# EAGLE design adder (EAGLE 7.6.0)
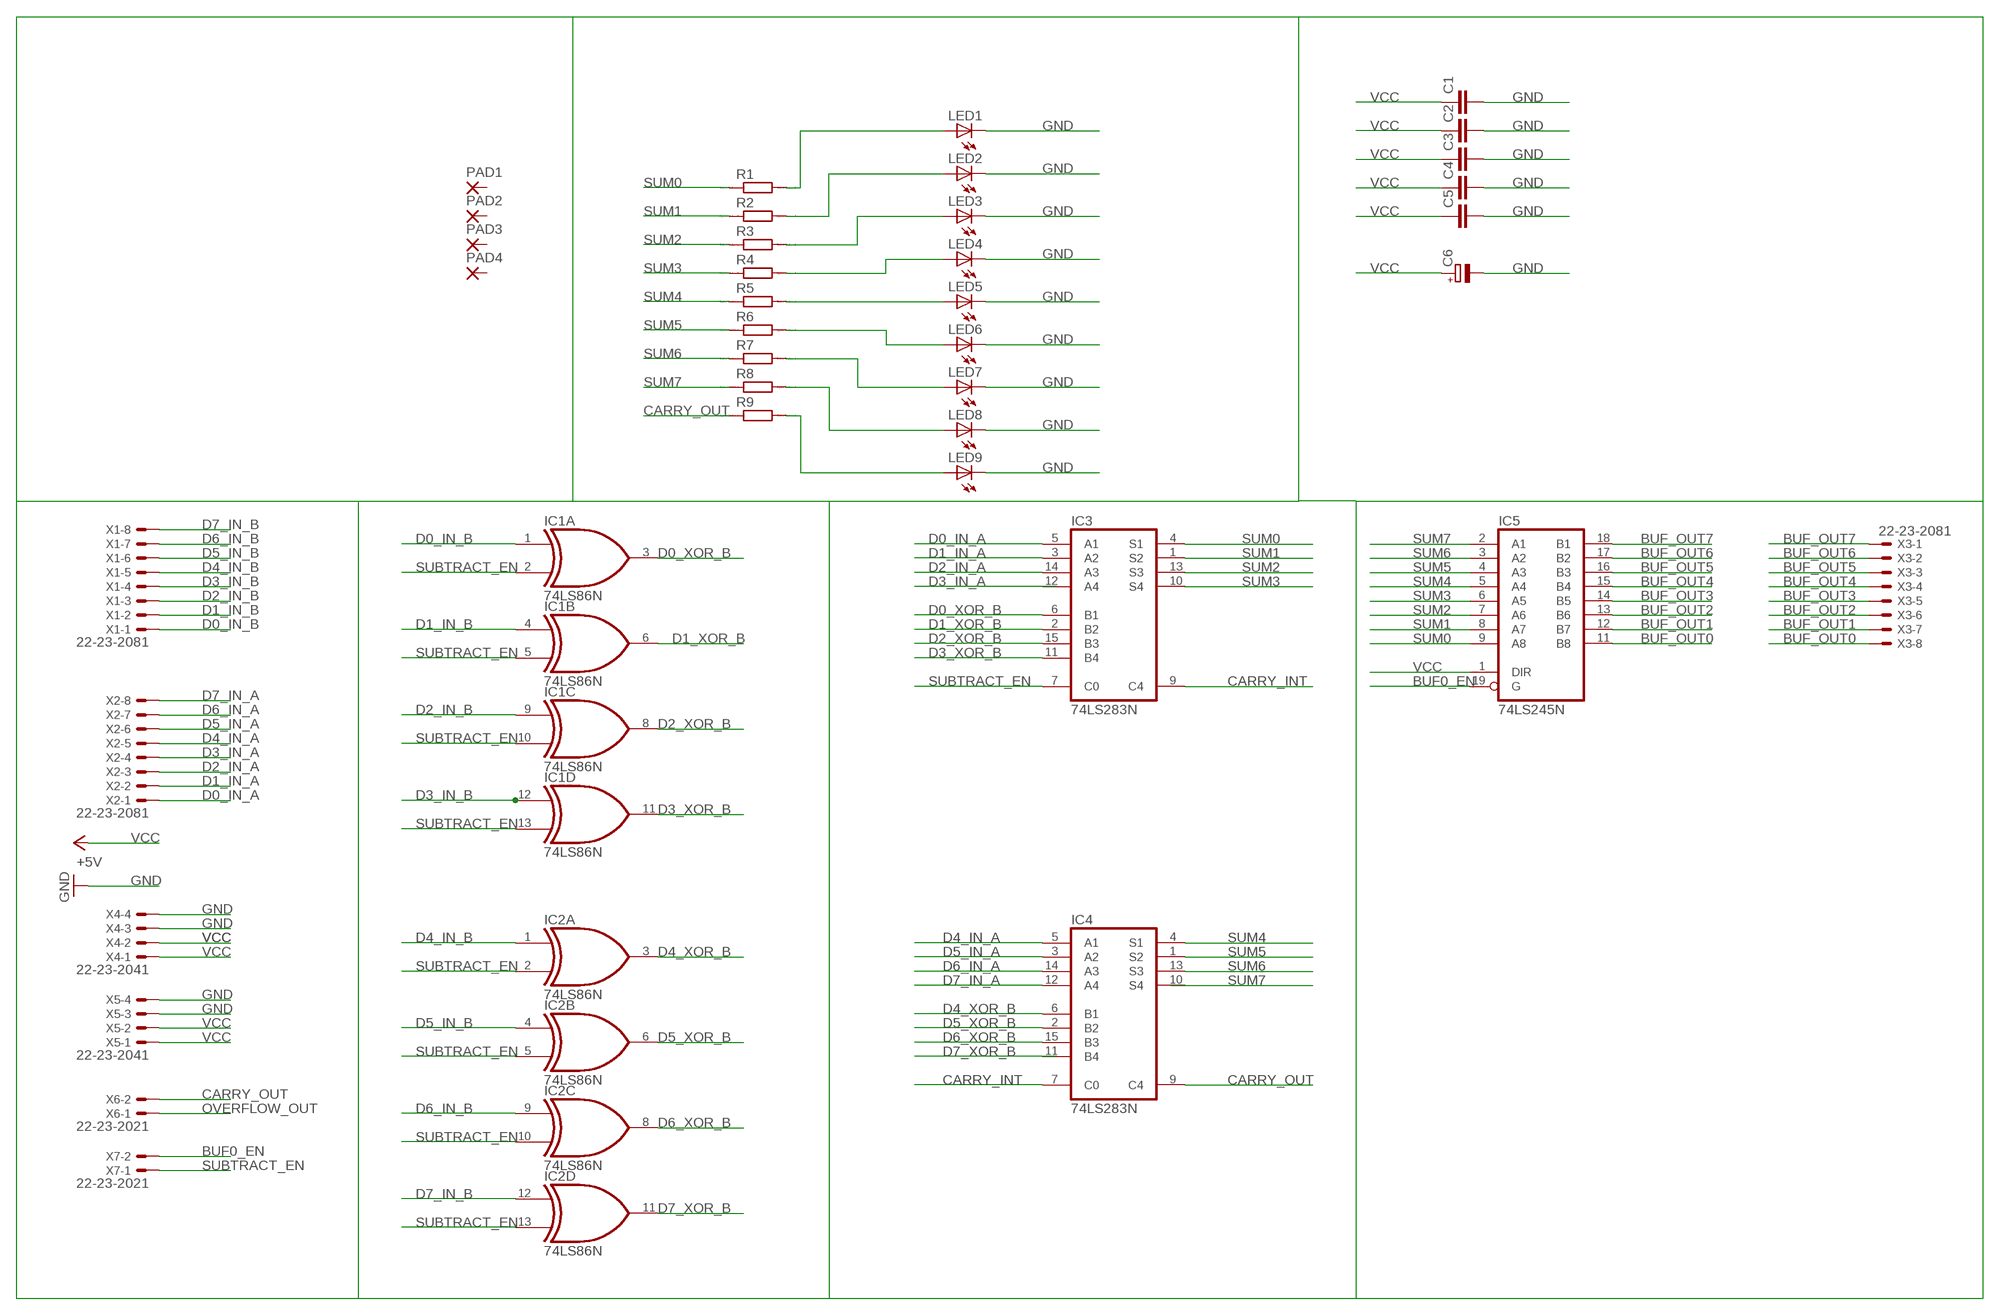
[diagram p0: schematic, sheet 1]

## Parts
C1  C-EU025-025X050  [C025-025X050]
C2  C-EU025-025X050  [C025-025X050]
C3  C-EU025-025X050  [C025-025X050]
C4  C-EU025-025X050  [C025-025X050]
C5  C-EU025-025X050  [C025-025X050]
C6  CPOL-EUE2.5-6  [E2,5-6]
IC1  74LS86N  [DIL14]
IC2  74LS86N  [DIL14]
IC3  74LS283N  [DIL16]
IC4  74LS283N  [DIL16]
IC5  74LS245N  [DIL20]
LED1  LED5MM  [LED5MM]
LED2  LED5MM  [LED5MM]
LED3  LED5MM  [LED5MM]
LED4  LED5MM  [LED5MM]
LED5  LED5MM  [LED5MM]
LED6  LED5MM  [LED5MM]
LED7  LED5MM  [LED5MM]
LED8  LED5MM  [LED5MM]
LED9  LED5MM  [LED5MM]
PAD1  3,17/1,3  [3,17/1,3]
PAD2  3,17/1,3  [3,17/1,3]
PAD3  3,17/1,3  [3,17/1,3]
PAD4  3,17/1,3  [3,17/1,3]
R1  R0207/10  [0207/10]
R2  R0207/10  [0207/10]
R3  R0207/10  [0207/10]
R4  R0207/10  [0207/10]
R5  R0207/10  [0207/10]
R6  R0207/10  [0207/10]
R7  R0207/10  [0207/10]
R8  R0207/10  [0207/10]
R9  R0207/10  [0207/10]
X1  22-23-2081  [22-23-2081]
X2  22-23-2081  [22-23-2081]
X3  22-23-2081  [22-23-2081]
X4  22-23-2041  [22-23-2041]
X5  22-23-2041  [22-23-2041]
X6  22-23-2021  [22-23-2021]
X7  22-23-2021  [22-23-2021]

## Nets
BUF0_EN: IC5.19(G) X7.2
BUF_OUT0: IC5.11(B8) X3.8
BUF_OUT1: IC5.12(B7) X3.7
BUF_OUT2: IC5.13(B6) X3.6
BUF_OUT3: IC5.14(B5) X3.5
BUF_OUT4: IC5.15(B4) X3.4
BUF_OUT5: IC5.16(B3) X3.3
BUF_OUT6: IC5.17(B2) X3.2
BUF_OUT7: IC5.18(B1) X3.1
CARRY_INT: IC3.9(C4) IC4.7(C0)
CARRY_OUT: IC4.9(C4) R9.1 X6.2
D0_IN_A: IC3.5(A1) X2.1
D0_IN_B: IC1.1(A:I0) X1.1
D0_XOR_B: IC1.3(A:O) IC3.6(B1)
D1_IN_A: IC3.3(A2) X2.2
D1_IN_B: IC1.4(B:I0) X1.2
D1_XOR_B: IC1.6(B:O) IC3.2(B2)
D2_IN_A: IC3.14(A3) X2.3
D2_IN_B: IC1.9(C:I0) X1.3
D2_XOR_B: IC1.8(C:O) IC3.15(B3)
D3_IN_A: X2.4
D3_IN_B: IC1.12(D:I0) X1.4
D3_XOR_B: IC1.11(D:O) IC3.11(B4)
D4_IN_A: IC4.5(A1) X2.5
D4_IN_B: IC2.1(A:I0) X1.5
D4_XOR_B: IC2.3(A:O) IC4.6(B1)
D5_IN_A: IC4.3(A2) X2.6
D5_IN_B: IC2.4(B:I0) X1.6
D5_XOR_B: IC2.6(B:O) IC4.2(B2)
D6_IN_A: IC4.14(A3) X2.7
D6_IN_B: IC2.9(C:I0) X1.7
D6_XOR_B: IC2.8(C:O) IC4.15(B3)
D7_IN_A: IC4.12(A4) X2.8
D7_IN_B: IC2.12(D:I0) X1.8
D7_XOR_B: IC2.11(D:O)
GND [suply]: C1.2 C2.2 C3.2 C4.2 C5.2 C6.- LED1.K(C) LED2.K(C) LED3.K(C) LED4.K(C) LED5.K(C) LED6.K(C) LED7.K(C) LED8.K(C) LED9.K(C) X4.3 X4.4 X5.3 X5.4
N$62: LED1.A R1.2
N$63: LED2.A R2.2
N$64: LED3.A R3.2
N$65: LED4.A R4.2
N$66: LED5.A R5.2
N$67: LED9.A R9.2
N$68: LED8.A R8.2
N$69: LED7.A R7.2
N$70: LED6.A R6.2
OVERFLOW_OUT: X6.1
SUBTRACT_EN: IC1.2(A:I1) IC1.5(B:I1) IC1.10(C:I1) IC1.13(D:I1) IC2.2(A:I1) IC2.5(B:I1) IC2.10(C:I1) IC2.13(D:I1) IC3.7(C0) X7.1
SUM0: IC3.4(S1) IC5.9(A8) R1.1
SUM1: IC3.1(S2) IC5.8(A7) R2.1
SUM2: IC3.13(S3) IC5.7(A6) R3.1
SUM3: IC3.10(S4) IC5.6(A5) R4.1
SUM4: IC4.4(S1) IC5.5(A4) R5.1
SUM5: IC4.1(S2) IC5.4(A3) R6.1
SUM6: IC4.13(S3) IC5.3(A2) R7.1
SUM7: IC5.2(A1) R8.1
VCC [suply]: C1.1 C2.1 C3.1 C4.1 C5.1 C6.+ IC5.1(DIR) X4.1 X4.2 X5.1 X5.2 ; supply symbol labelled +5V
Unconnected: IC3.12(A4) IC4.10(S4) IC4.11(B4) PAD1.1(P) PAD2.1(P) PAD3.1(P) PAD4.1(P)

## Power pins joined to a net without a drawn wire
GND: IC1.7(P:GND) IC2.7(P:GND) IC3.8(GND) IC4.8(GND) IC5.10(GND)
VCC: IC1.14(P:VCC) IC2.14(P:VCC) IC3.16(VCC) IC4.16(VCC) IC5.20(VCC)

## Library data of the parts
C1-C5 = rcl:C-EU: CAPACITOR, European symbol
C6 = rcl:CPOL-EU: POLARIZED CAPACITOR, European symbol
IC1 IC2 = 74xx-us:74*86: Quad 2-input EXCLUSIV-OR (XOR) gate
IC3 IC4 = 74xx-us:74*283: 4-bit binary FULL ADDER, fast carry
IC5 = 74xx-us:74*245: Octal BUS TRANSCEIVER, 3-state
LED1-LED9 = led:LED: LED OSRAM: - CHIPLED LG R971, LG N971, LY N971, LG Q971, LY Q971, LO R971, LY R971 LH N974, LH R974 LS Q976, LO Q976, LY Q976 LO Q996 - Hyper CHIPLED LW Q18S LB Q993, LB Q99A, LB R99A - SideLED LS A670, LO A670, LY A670, LG A670, LP A670 LB A673, LV A673, LT A673, LW A673 LH A674 LY A675 LS A676, LA A676, LO A676, LY A676, LW A676 LS A679, LY A679, LG A679 - Hyper Micro SIDELED® LS Y876, LA Y876, LO Y876, LY Y876 LT Y87S - SmartLED LW L88C, LW L88S LB L89C, LB L89S, LG L890 LS L89K, LO L89K, LY L89K LS L896, LA L896, LO L896, LY L896 - TOPLED LS T670, LO T670, LY T670, LG T670, LP T670 LSG T670, LSP T670, LSY T670, LOP T670, LYG T670 LG T671, LOG T671, LSG T671 LB T673, LV T673, LT T673, LW T673 LH T674 LS T676, LA T676, LO T676, LY T676, LB T676, LH T676, LSB T676, LW T676 LB T67C, LV T67C, LT T67C, LS T67K, LO T67K, LY T67K, LW E67C LS E67B, LA E67B, LO E67B, LY E67B, LB E67C, LV E67C, LT E67C LW T67C LS T679, LY T679, LG T679 LS T770, LO T770, LY T770, LG T770, LP T770 LB T773, LV T773, LT T773, LW T773 LH T774 LS E675, LA E675, LY E675, LS T675 LS T776, LA T776, LO T776, LY T776, LB T776 LHGB T686 LT T68C, LB T68C - Hyper Mini TOPLED® LB M676 - Mini TOPLED Santana® LG M470 LS M47K, LO M47K, LY M47K Source: http://www.osram.convergy.de LUXEON: - LUMILED® LXK2-PW12-R00, LXK2-PW12-S00, LXK2-PW14-U00, LXK2-PW14-V00 LXK2-PM12-R00, LXK2-PM12-S00, LXK2-PM14-U00 LXK2-PE12-Q00, LXK2-PE12-R00, LXK2-PE12-S00, LXK2-PE14-T00, LXK2-PE14-U00 LXK2-PB12-K00, LXK2-PB12-L00, LXK2-PB12-M00, LXK2-PB14-N00, LXK2-PB14-P00, LXK2-PB14-Q00 LXK2-PR12-L00, LXK2-PR12-M00, LXK2-PR14-Q00, LXK2-PR14-R00 LXK2-PD12-Q00, LXK2-PD12-R00, LXK2-PD12-S00 LXK2-PH12-R00, LXK2-PH12-S00 LXK2-PL12-P00, LXK2-PL12-Q00, LXK2-PL12-R00 Source: www.luxeon.com KINGBRIGHT: KA-3528ASYC Source: www.kingbright.com
PAD1-PAD4 = wirepad:3,17/1,3: THROUGH-HOLE PAD
R1-R9 = eagle-ltspice:R: RESISTOR, European symbol; SPICEMODEL: NONE; SPICEPREFIX: R
X1-X3 = con-molex:22-23-2081: .100" (2.54mm) Center Header - 8 Pin; MF: MOLEX; MPN: 22-23-2081; OC_FARNELL: 1756826; OC_NEWARK: 01C7592
X4 X5 = con-molex:22-23-2041: .100" (2.54mm) Center Header - 4 Pin; MF: MOLEX; MPN: 22-23-2041; OC_FARNELL: 1462920; OC_NEWARK: 38C0355
X6 X7 = con-molex:22-23-2021: .100" (2.54mm) Center Header - 2 Pin; MF: MOLEX; MPN: 22-23-2021; OC_FARNELL: 1462926; OC_NEWARK: 25C3832

## Net classes
1 suply: width 1.016 mm

## Board
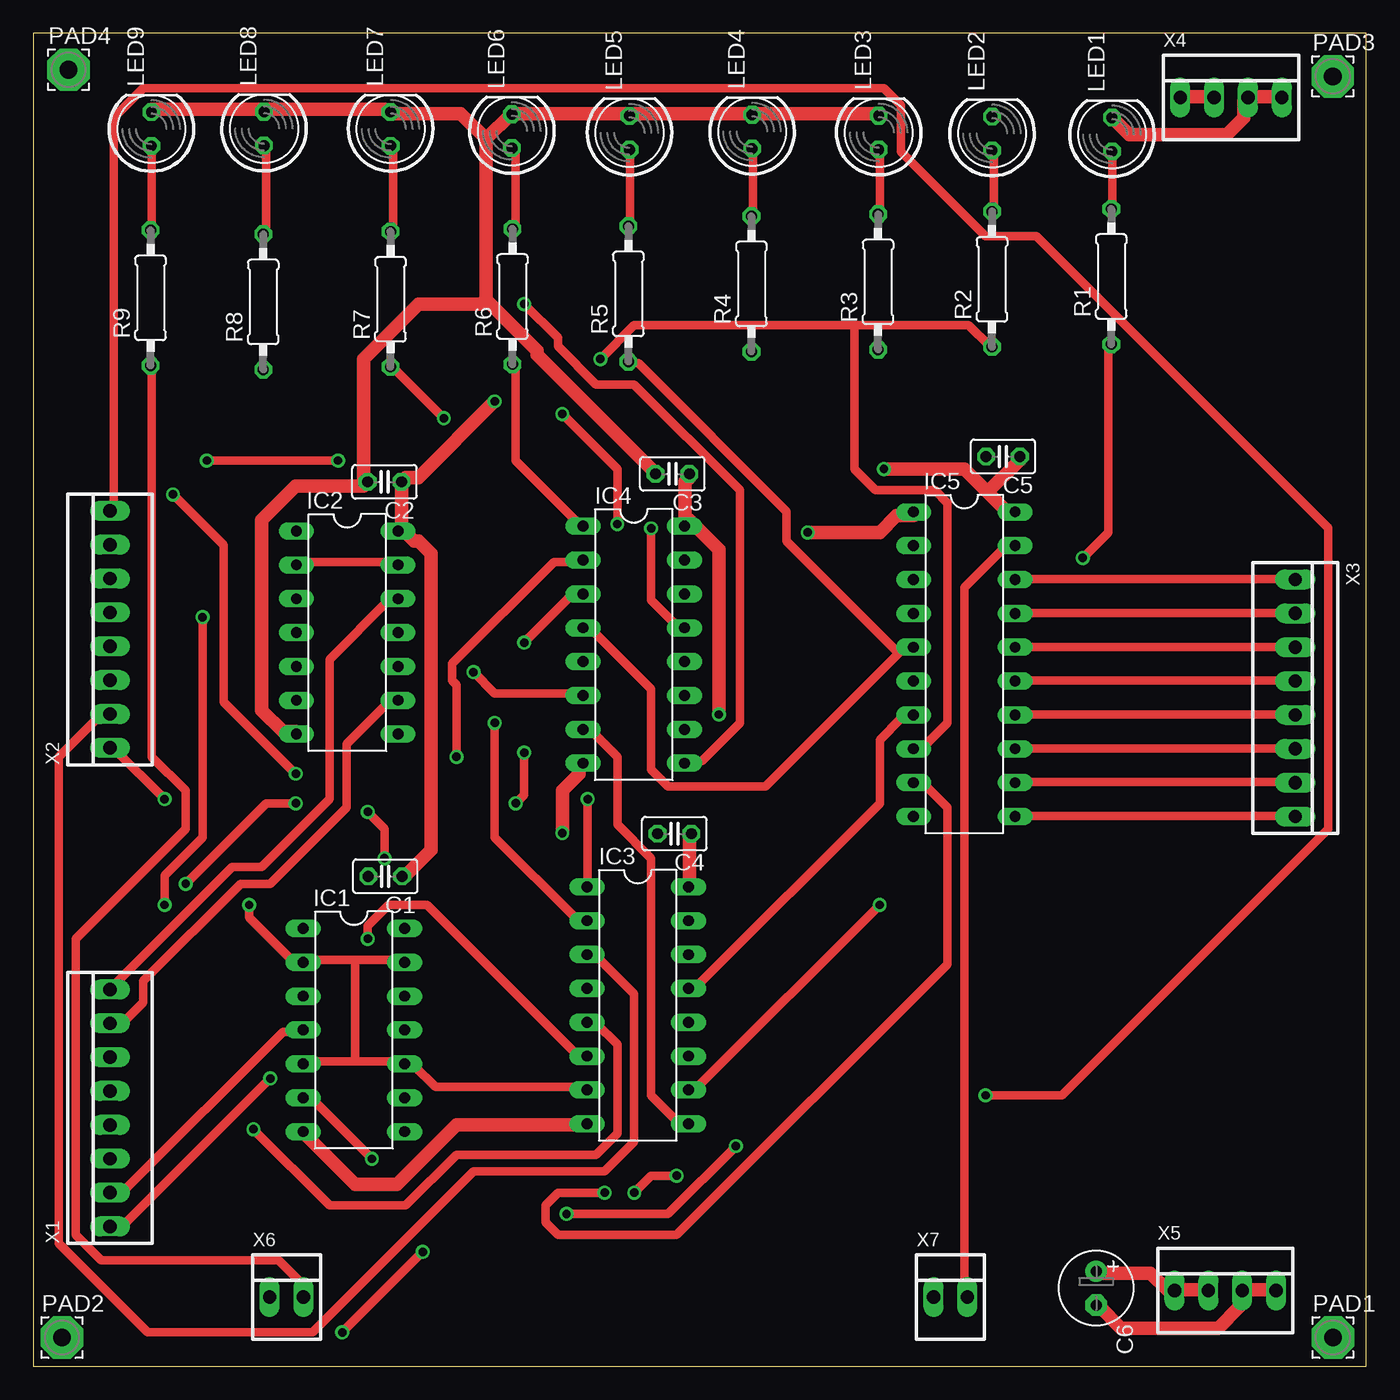
[diagram p1: board, top side]
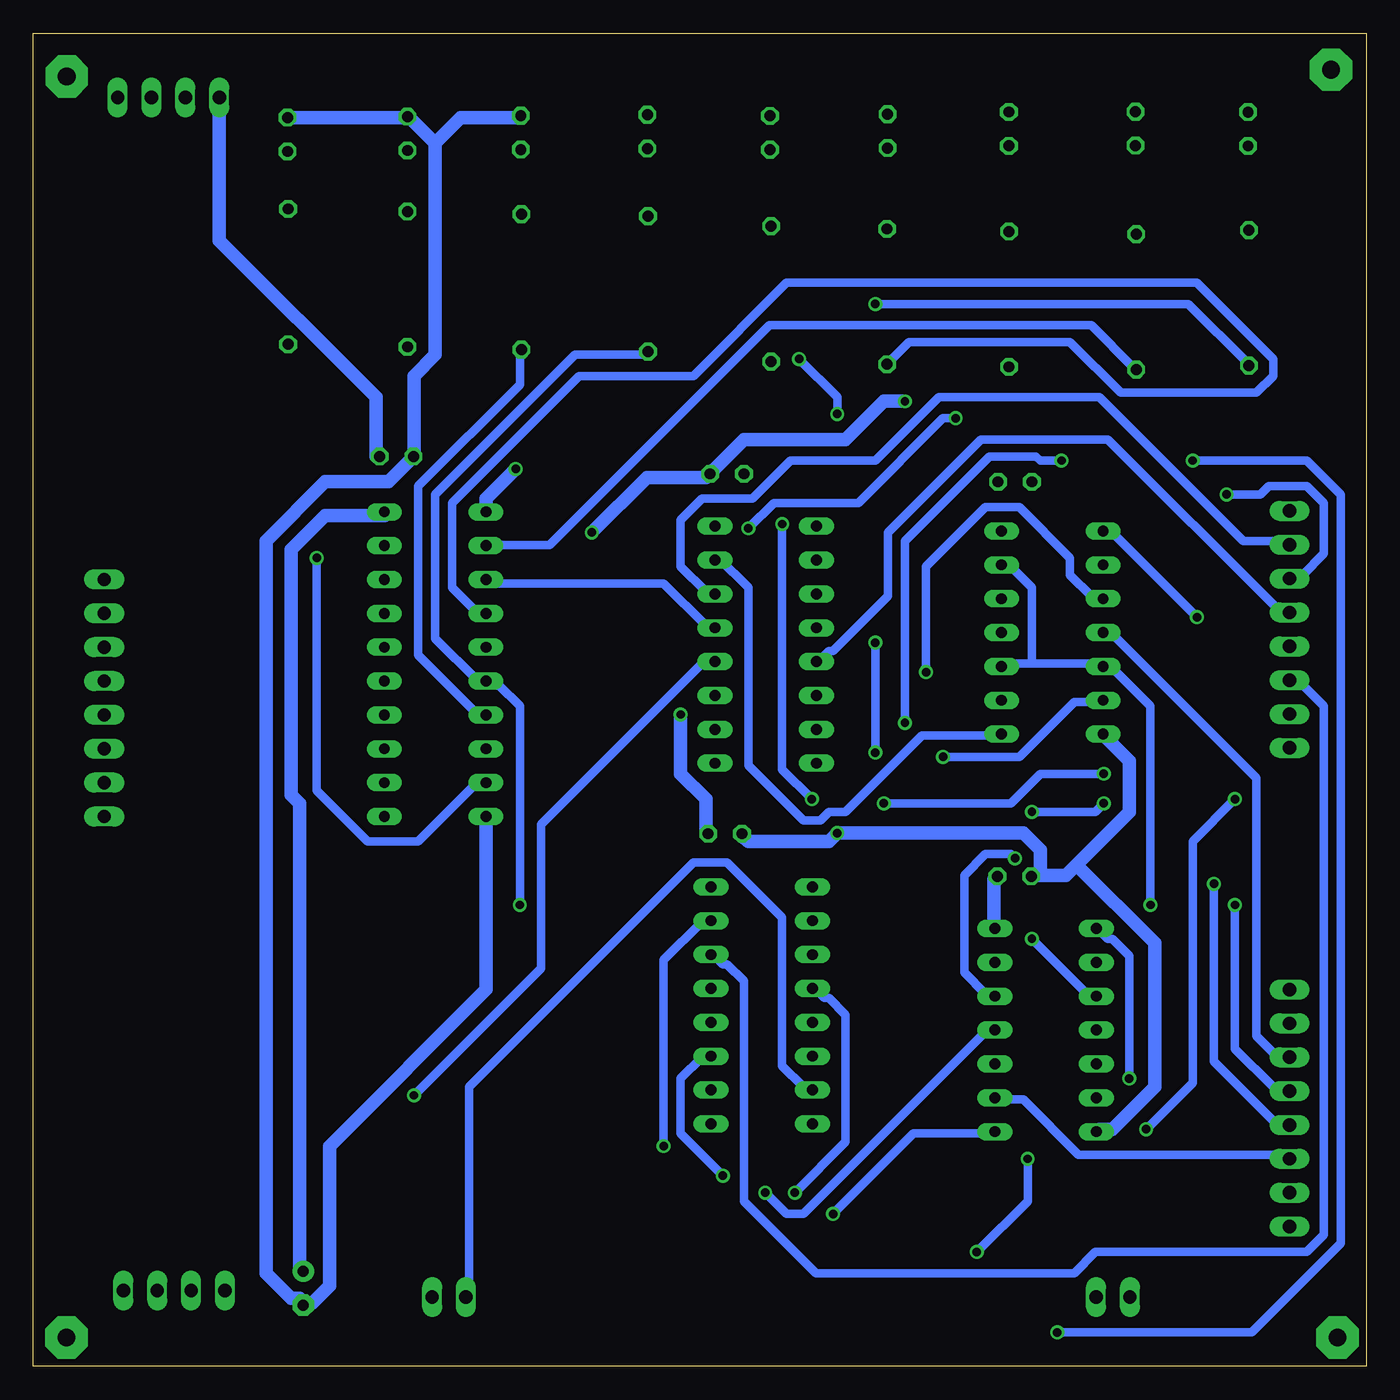
[diagram p2: board, bottom side, seen from below]

Size 100 x 100 mm. Coordinates in mm from the lower left corner, seen from the top.
Outline: 0,0 100,0 100,100 0,100 0,0
Copper layers (1*16): Top 0.035mm / dielectric 1.5mm / Bottom 0.035mm
Design rules "default *": minimum track width 25mil, minimum drill 25mil, track to track 25mil, track to pad 25mil, pad to pad 25mil, via to via 25mil, smd to smd 8mil, copper to edge 40mil, drill to drill 8mil, minimum pad ring 10mil, minimum via ring 8mil, stop-mask expansion 4mil, vias tented up to drill 0mil, thermal gap 10mil

### Footprints (pad centres in the part's own frame; a part is rotated, then mirrored left to right if it is on the bottom)
C025-025X050 = drill 0.813 octagon: 1 -1.27,0; 2 1.27,0
E2,5-6 = drill 0.813 pad 1.6: + -1.27,0 | drill 0.813 pad 1.6 octagon: - 1.27,0
DIL14 = drill 0.813 long: 1 -7.62,-3.81; 2 -5.08,-3.81; 3 -2.54,-3.81; 4 0,-3.81; 5 2.54,-3.81; 6 5.08,-3.81; 7 7.62,-3.81; 8 7.62,3.81; 9 5.08,3.81; 10 2.54,3.81; 11 0,3.81; 12 -2.54,3.81; 13 -5.08,3.81; 14 -7.62,3.81
DIL16 = drill 0.813 long: 1 -8.89,-3.81; 2 -6.35,-3.81; 3 -3.81,-3.81; 4 -1.27,-3.81; 5 1.27,-3.81; 6 3.81,-3.81; 7 6.35,-3.81; 8 8.89,-3.81; 9 8.89,3.81; 10 6.35,3.81; 11 3.81,3.81; 12 1.27,3.81; 13 -1.27,3.81; 14 -3.81,3.81; 15 -6.35,3.81; 16 -8.89,3.81
DIL20 = drill 0.813 long: 1 -11.43,-3.81; 2 -8.89,-3.81; 3 -6.35,-3.81; 4 -3.81,-3.81; 5 -1.27,-3.81; 6 1.27,-3.81; 7 3.81,-3.81; 8 6.35,-3.81; 9 8.89,-3.81; 10 11.43,-3.81; 11 11.43,3.81; 12 8.89,3.81; 13 6.35,3.81; 14 3.81,3.81; 15 1.27,3.81; 16 -1.27,3.81; 17 -3.81,3.81; 18 -6.35,3.81; 19 -8.89,3.81; 20 -11.43,3.81
LED5MM = drill 0.813 octagon: A -1.27,0; K 1.27,0
3,17/1,3 = drill 1.321 pad 3.175 octagon: 1 0,0
0207/10 = drill 0.813 octagon: 1 -5.08,0; 2 5.08,0
22-23-2081 = drill 1 long: 1 -8.89,0; 2 -6.35,0; 3 -3.81,0; 4 -1.27,0; 5 1.27,0; 6 3.81,0; 7 6.35,0; 8 8.89,0
22-23-2041 = drill 1 long: 1 -3.81,0; 2 -1.27,0; 3 1.27,0; 4 3.81,0
22-23-2021 = drill 1 long: 1 -1.27,0; 2 1.27,0

### Placement (x,y rotation side)
C1  26.4,36.75 180 top
C2  26.35,66.35 180 top
C3  47.95,66.95 180 top
C4  48.1,39.95 180 top
C5  72.75,68.25 180 top
C6  79.75,5.85 270 top
IC1  24.05,25.22 270 top
IC2  23.55,55.04 270 top
IC3  45.35,27.07 270 top
IC4  45.05,54.13 270 top
IC5  69.85,52.67 270 top
LED1  80.93,92.41 90 top
LED2  71.93,92.48 90 top
LED3  63.43,92.55 90 top
LED4  53.93,92.62 90 top
LED5  44.73,92.54 90 top
LED6  35.91,92.66 90 top
LED7  26.81,92.83 90 top
LED8  17.31,92.85 90 top
LED9  8.86,92.82 90 top
PAD1  97.5,2.15 0 top
PAD2  2.15,2.15 0 top
PAD3  97.49,96.77 0 top
PAD4  2.64,97.27 0 top
R1  80.88,81.75 90 top
R2  71.93,81.55 90 top
R3  63.38,81.35 90 top
R4  53.88,81.2 90 top
R5  44.65,80.45 90 top
R6  35.95,80.25 90 top
R7  26.8,80.05 90 top
R8  17.25,79.85 90 top
R9  8.8,80.15 90 top
X1  5.75,19.37 90 top
X2  5.75,55.28 90 top
X3  94.68,50.13 270 top
X4  89.86,95.18 0 top
X5  89.43,5.68 0 top
X6  19,5.18 0 top
X7  68.81,5.18 0 top

### Tracks (layer width: path | path; a pad name or v marks a point on that pad's centre or on a via)
BUF0_EN
  Top 0.635: IC5.19 73.66,61.28 72.71,61.28 69.85,58.42 69.85,5.4 X7.2
BUF_OUT0
  Top 0.635: IC5.11 73.66,41.27 94.61,41.27 X3.8
BUF_OUT1
  Top 0.635: IC5.12 73.66,43.81 94.61,43.81 X3.7
BUF_OUT2
  Top 0.635: IC5.13 73.66,46.35 94.61,46.35 X3.6
BUF_OUT3
  Top 0.635: IC5.14 73.66,48.9 94.61,48.9 X3.5
BUF_OUT4
  Top 0.635: IC5.15 73.66,51.44 94.61,51.44 X3.4
BUF_OUT5
  Top 0.635: IC5.16 73.66,53.98 94.61,53.98 X3.3
BUF_OUT6
  Top 0.635: IC5.17 73.66,56.52 94.61,56.52 X3.2
BUF_OUT7
  Top 0.635: IC5.18 73.66,59.05 94.61,59.05 X3.1
CARRY_INT
  Top 0.635: IC3.9 48.9,18.41 48.26,18.41 46.35,20.32 46.35,38.1 43.81,40.64 43.81,45.72 41.91,47.62 41.27,47.62 IC4.7
CARRY_OUT  (via drill 0.64)
  Top 0.635: R9.1 8.89,74.93 8.89,45.72 11.43,43.18 11.43,40.32 3.17,32.07 3.17,9.84 5.08,7.94 18.41,7.94 20,6.35 20,5.4 X6.2 | v36.83,79.69 39.37,77.15 39.37,76.52 42.23,73.66 45.09,73.66 53.02,65.72 53.02,48.26 50.16,45.4 48.9,45.4 IC4.9
  Bottom 0.635: v36.83,79.69 13.34,79.69 8.89,75.25 R9.1
D0_IN_A  (via drill 0.64)
  Top 0.635: v16.51,17.78 22.23,12.06 27.94,12.06 31.75,15.88 42.23,15.88 43.81,17.46 43.81,24.13 42.23,25.72 41.59,25.72 IC3.5 | v9.84,42.55 6.03,46.35 X2.1
  Bottom 0.635: v16.51,17.78 13.02,21.27 13.02,39.37 v9.84,42.55
D0_IN_B  (via drill 0.64)
  Top 0.635: v17.78,21.59 6.99,10.79 6.03,10.79 X1.1
  Bottom 0.635: v17.78,21.59 17.78,30.8 19.05,32.07 19.37,32.07 20,32.7 IC1.1
D0_XOR_B  (via drill 0.64)
  Top 0.635: v25.08,32.07 25.08,33.02 26.67,34.61 29.53,34.61 40.64,23.5 41.27,23.5 IC3.6
  Bottom 0.635: v25.08,32.07 20.95,27.94 20.32,27.94 IC1.3
D1_IN_A
  Top 0.635: IC3.3 41.59,30.8 42.23,30.8 45.09,27.94 45.09,16.83 42.86,14.61 33.02,14.61 20.95,2.54 8.57,2.54 1.91,9.21 1.91,45.72 5.08,48.9 5.71,48.9 X2.2
D1_IN_B
  Top 0.635: IC1.4 20,25.08 18.73,25.08 6.99,13.34 6.03,13.34 X1.2
D1_XOR_B  (via drill 0.64)
  Top 0.635: v25.4,15.56 20.95,20 20.32,20 IC1.6 | v23.18,2.54 v29.21,8.57 | v22.86,67.94 v13.02,67.94 | v34.61,48.26 34.61,39.69 40.64,33.66 41.27,33.66 IC3.2
  Bottom 0.635: v25.4,15.56 25.4,12.38 v29.21,8.57 | v23.18,2.54 8.57,2.54 1.91,9.21 1.91,65.41 4.45,67.94 v13.02,67.94 | v22.86,67.94 24.45,67.94 24.77,68.26 28.26,68.26 34.61,61.91 v34.61,48.26
D2_IN_A
  Bottom 0.635: IC3.14 48.9,30.8 48.26,30.16 47.94,30.16 46.67,28.89 46.67,12.38 41.27,6.99 21.91,6.99 20.32,8.57 4.45,8.57 3.17,9.84 3.17,49.53 5.08,51.44 5.71,51.44 X2.3
D2_IN_B
  Bottom 0.635: IC1.9 27.62,20 25.72,20 21.59,15.88 6.03,15.88 X1.3
D2_XOR_B  (via drill 0.64)
  Top 0.635: v40.01,11.43 47.62,11.43 v52.7,16.51
  Bottom 0.635: v40.01,11.43 33.97,17.46 27.94,17.46 IC1.8 | v52.7,16.51 52.7,30.48 49.85,33.34 49.21,33.34 IC3.15
D3_IN_B  (via drill 0.64)
  Top 0.635: v26.35,38.1 26.35,40.32 v25.08,41.59 | v19.68,42.23 17.46,42.23 v11.43,36.2
  Bottom 0.635: v26.35,38.1 26.67,38.42 28.57,38.42 30.16,36.83 30.16,29.53 28.57,27.94 27.94,27.94 IC1.12 | v25.08,41.59 20.32,41.59 v19.68,42.23 | v11.43,36.2 11.43,22.86 6.99,18.41 6.03,18.41 X1.4
D3_XOR_B  (via drill 0.64)
  Top 0.635: v48.26,14.29 46.35,14.29 v45.09,13.02
  Bottom 0.635: v48.26,14.29 51.44,17.46 51.44,21.59 49.85,23.18 49.21,23.18 IC3.11 | v45.09,13.02 43.5,11.43 42.23,11.43 28.57,25.08 27.94,25.08 IC1.11
D4_IN_A
  Bottom 0.635: IC4.5 40.96,53.02 40.32,53.66 40.01,53.66 35.88,57.78 35.88,62.55 28.89,69.53 19.37,69.53 6.67,56.83 6.03,56.83 X2.5
D4_IN_B  (via drill 0.64)
  Top 0.635: v12.7,56.2 12.7,39.69 9.84,36.83 v9.84,34.61
  Bottom 0.635: v12.7,56.2 19.05,62.55 19.68,62.55 IC2.1 | v9.84,34.61 9.84,23.81 6.99,20.95 6.03,20.95 X1.5
D4_XOR_B  (via drill 0.64)
  Top 0.635: v33.02,52.07 34.61,50.48 40.96,50.48 IC4.6
  Bottom 0.635: v33.02,52.07 33.02,60.01 28.57,64.45 26.04,64.45 22.23,60.64 22.23,59.37 20.64,57.78 20,57.78 IC2.3
D5_IN_A  (via drill 0.64)
  Top 0.635: v36.83,54.29 40.32,57.78 40.96,57.78 IC4.3 | v36.83,46.04 36.83,42.86 v36.2,42.23 | v19.68,44.45 14.29,49.85 14.29,61.59 v10.48,65.41
  Bottom 0.635: v36.83,46.04 v36.83,54.29 | v36.2,42.23 26.67,42.23 24.45,44.45 v19.68,44.45 | v10.48,65.41 7.94,65.41 7.3,66.04 4.45,66.04 3.17,64.77 3.17,60.96 4.76,59.37 5.71,59.37 X2.6
D5_IN_B
  Bottom 0.635: IC2.4 19.68,54.93 19.05,54.93 8.26,44.13 8.26,24.77 6.99,23.5 6.03,23.5 X1.6
D5_XOR_B  (via drill 0.64)
  Top 0.635: v31.75,45.72 31.75,51.12 31.43,51.44 31.43,52.7 39.05,60.33 40.96,60.33 IC4.2
  Bottom 0.635: v31.75,45.72 26.04,45.72 21.91,49.85 20,49.85 IC2.6
D6_IN_A
  Bottom 0.635: IC4.14 48.9,58.1 49.53,58.1 51.44,60.01 51.44,63.5 49.85,65.09 46.04,65.09 43.18,67.94 36.83,67.94 32.07,72.71 20,72.71 9.21,61.91 6.03,61.91 X2.7
D6_IN_B
  Top 0.635: IC2.9 27.3,49.85 26.67,49.85 23.5,46.67 23.5,41.91 17.78,36.2 15.56,36.2 8.26,28.89 8.26,27.3 6.99,26.04 6.03,26.04 X1.7
D6_XOR_B
  Bottom 0.635: IC2.8 27.62,47.31 33.34,47.31 39.05,41.59 40.32,41.59 40.96,40.96 42.23,40.96 46.35,45.09 46.35,58.42 48.58,60.64 IC4.15
D7_IN_A  (via drill 0.64)
  Top 0.635: v71.44,20.32 77.15,20.32 97.16,40.32 97.16,62.87 75.25,84.77 71.44,84.77 65.09,91.12 65.09,94.61 63.82,95.89 8.26,95.89 6.03,93.66 6.03,64.45 X2.8
  Bottom 0.635: v71.44,20.32 61.91,29.84 61.91,40.64 49.85,52.7 48.9,52.7 IC4.12
D7_IN_B
  Top 0.635: IC2.12 27.3,57.47 26.67,57.47 22.23,53.02 22.23,42.55 17.14,37.47 14.92,37.47 6.03,28.57 X1.8
GND  (via drill 0.64)
  Top 1.016: v39.69,40.01 39.69,43.18 40.96,44.45 40.96,45.09 IC4.8 | IC2.7 19.68,47.62 18.73,47.62 17.14,49.21 17.14,63.5 19.68,66.04 24.77,66.04 C2.2 24.77,66.67 24.77,75.56 28.89,79.69 33.66,79.69 33.97,80.01 | IC3.8 41.27,18.1 31.75,18.1 27.3,13.65 24.13,13.65 20.32,17.46 IC1.7 | X5.4 93.03,5.71 90.81,5.71 X5.3 90.49,5.4 90.49,4.45 88.9,2.86 81.6,2.86 80.01,4.45 C6.- | X4.4 93.66,95.25 91.44,95.25 X4.3 90.81,94.93 90.81,93.66 89.53,92.39 82.23,92.39 80.96,93.66 LED1.K | LED9.K 8.89,94.3 17.14,94.3 LED8.K 17.78,94.3 26.35,94.3 LED7.K 26.99,93.98 32.07,93.98 33.97,92.08 | 33.97,80.01 37.78,76.2 37.78,75.88 46.67,66.99 C3.2 | 33.97,92.08 33.97,80.01 | 33.97,92.08 35.88,93.98 LED6.K 36.2,93.98 44.45,93.98 LED5.K 45.09,93.98 53.66,93.98 LED4.K 54.29,93.98 63.18,93.98 LED3.K
  Bottom 1.016: C4.2 46.67,39.69 46.35,39.37 40.32,39.37 v39.69,40.01 25.72,40.01 24.45,38.73 24.45,36.83 | 21.75,37.62 22.54,36.83 24.45,36.83 | 21.75,37.62 17.78,41.59 17.78,45.4 19.68,47.31 IC2.7 | 24.45,36.83 25.08,36.83 C1.2 | 21.75,37.62 15.88,31.75 15.88,20.95 19.05,17.78 20,17.78 IC1.7 | IC5.10 66.04,28.26 77.79,16.51 77.79,6.03 79.06,4.76 79.69,4.76 C6.- 80.01,5.08 80.64,5.08 82.55,6.99 82.55,61.91 78.11,66.36 73.34,66.36 71.75,67.94 C5.2 71.44,68.26 71.44,74.3 69.85,75.88 69.85,91.76 | 69.85,91.76 71.75,93.66 LED2.K 72.39,93.66 80.64,93.66 LED1.K | 69.85,91.76 67.94,93.66 63.5,93.66 LED3.K
N$62
  Top 0.635: R1.2 80.96,87 80.96,91.12 LED1.A
N$63
  Top 0.635: R2.2 72.07,86.68 72.07,91.12 LED2.A
N$64
  Top 0.635: R3.2 63.5,86.68 63.5,91.12 LED3.A
N$65
  Top 0.635: R4.2 53.98,86.36 53.98,91.12 LED4.A
N$66
  Top 0.635: R5.2 44.77,85.72 44.77,91.12 LED5.A
N$67
  Top 0.635: R9.2 8.89,85.41 8.89,91.44 LED9.A
N$68
  Top 0.635: R8.2 17.46,85.09 17.46,91.44 LED8.A
N$69
  Top 0.635: R7.2 26.99,85.41 26.99,91.44 LED7.A
N$70
  Top 0.635: LED6.A 36.2,91.12 36.2,85.41 R6.2
SUBTRACT_EN  (via drill 0.64)
  Top 0.635: IC2.2 20,60.33 27.3,60.33 IC2.13 | 24.13,30.48 27.62,30.48 IC1.13 | 24.13,30.48 20.32,30.48 IC1.2 20,30.48 19.37,30.48 16.19,33.66 v16.19,34.61 | 24.13,22.86 27.62,22.86 IC1.10 27.94,22.54 28.57,22.54 30.16,20.95 41.27,20.95 IC3.7 | 24.13,22.86 20.32,22.86 IC1.5 | 24.13,22.86 24.13,30.48
  Bottom 0.635: 25.08,52.7 27.3,52.7 IC2.10 | 25.08,52.7 20,52.7 IC2.5 19.68,52.39 19.05,52.39 16.19,49.53 v16.19,34.61 | 25.08,52.7 25.08,58.42 26.67,60.01 27.3,60.01 IC2.13 | X7.1 67.31,5.4 67.31,20.95 50.48,37.78 47.94,37.78 43.81,33.66 43.81,22.54 42.23,20.95 41.59,20.95 IC3.7
SUM0  (via drill 0.64)
  Top 0.635: v42.86,13.02 39.37,13.02 38.42,12.06 38.42,10.79 39.37,9.84 48.26,9.84 68.58,30.16 68.58,41.91 66.99,43.5 66.04,43.5 IC5.9 | v78.74,60.64 80.64,62.55 80.64,76.52 R1.1
  Bottom 0.635: v42.86,13.02 39.05,16.83 39.05,26.35 40.32,27.62 40.64,27.62 41.27,28.26 IC3.4 | v78.74,60.64 78.74,43.18 74.93,39.37 71.12,39.37 66.99,43.5 66.04,43.5 IC5.9
SUM1  (via drill 0.64)
  Top 0.635: v41.59,42.55 41.59,36.2 IC3.1 | v43.81,63.18 43.81,67.31 v39.69,71.44 | v42.55,75.56 45.09,78.11 61.59,78.11 | 61.59,78.11 70.17,78.11 71.75,76.52 R2.1 | 61.59,78.11 61.59,67.31 63.18,65.72 67.63,65.72 68.58,64.77 68.58,48.26 66.67,46.35 66.04,46.35 IC5.8
  Bottom 0.635: v41.59,42.55 43.81,44.77 v43.81,63.18 | v39.69,71.44 39.69,72.71 v42.55,75.56
SUM2
  Top 0.635: IC3.13 49.21,28.57 49.85,28.57 63.5,42.23 63.5,46.99 65.09,48.58 66.04,48.58 IC5.7
  Bottom 0.635: R3.1 63.5,76.2 63.5,73.66 71.12,66.04 71.12,53.34 66.67,48.9 66.04,48.9 IC5.7
SUM3  (via drill 0.64)
  Top 0.635: v63.5,34.61 49.85,20.95 49.21,20.95 IC3.10
  Bottom 0.635: v63.5,34.61 63.5,49.53 65.09,51.12 66.04,51.12 IC5.6 66.04,51.44 66.67,51.44 69.85,54.61 69.85,65.41 59.37,75.88 53.98,75.88 R4.1
SUM4
  Top 0.635: IC4.4 41.27,55.24 41.91,55.24 46.35,50.8 46.35,44.77 47.62,43.5 54.93,43.5 65.09,53.66 66.04,53.66 IC5.5 64.77,53.66 56.52,61.91 56.52,64.14 45.4,75.25 44.77,75.25 R5.1
SUM5
  Top 0.635: R6.1 36.2,74.93 36.2,67.94 40.96,63.18 IC4.1
  Bottom 0.635: IC5.4 66.04,56.52 66.67,56.52 68.58,58.42 68.58,64.77 59.05,74.3 50.48,74.3 43.5,81.28 12.7,81.28 6.99,75.56 6.99,74.3 8.26,73.03 18.41,73.03 22.23,76.83 34.29,76.83 35.88,75.25 R6.1
SUM6  (via drill 0.64)
  Top 0.635: v30.8,71.12 26.99,74.93 R7.1 | v46.35,62.87 46.35,57.47 48.58,55.24 IC4.13
  Bottom 0.635: v30.8,71.12 31.75,71.12 38.1,64.77 44.45,64.77 v46.35,62.87 | IC5.3 66.04,58.74 52.7,58.74 49.53,55.56 48.9,55.56 IC4.13
SUM7
  Bottom 0.635: IC5.2 66.04,61.59 61.28,61.59 44.77,78.11 20.64,78.11 17.46,74.93 R8.1
VCC  (via drill 0.64)
  Top 1.016: C1.1 27.94,36.83 29.84,38.73 29.84,60.96 28.89,61.91 28.57,61.91 27.94,62.55 IC2.14 27.62,62.87 27.62,66.04 C2.1 27.94,66.67 28.89,66.67 v34.61,72.39 | IC3.16 49.21,36.2 49.21,39.69 C4.1 | C3.1 49.21,66.67 48.9,66.36 48.9,63.18 IC4.16 49.21,63.5 51.44,61.28 v51.44,48.9 | X5.2 87.95,5.71 85.72,5.71 X5.1 85.09,5.71 83.82,6.99 80.01,6.99 C6.+ | X4.1 86.36,95.25 88.58,95.25 X4.2 | v63.82,67.31 69.85,67.31 71.6,65.56 | 71.6,65.56 73.03,64.14 73.66,64.14 IC5.20 | 71.6,65.56 73.98,67.94 C5.1 | v58.1,62.55 63.5,62.55 64.77,63.82 66.04,63.82 IC5.1
  Bottom 1.016: IC1.14 27.94,33.02 27.94,36.51 C1.1 | v51.44,48.9 51.44,44.45 49.53,42.55 49.53,40.01 C4.1 | IC5.1 66.04,65.09 v63.82,67.31 | X4.1 86.04,94.93 86.04,84.45 74.3,72.71 74.3,68.26 C5.1 | C6.+ 80.01,7.3 80.01,42.23 80.64,42.86 80.64,61.28 78.11,63.82 73.66,63.82 IC5.20 | v58.1,62.55 53.98,66.67 49.53,66.67 C3.1 48.9,67.31 46.67,69.53 39.05,69.53 36.2,72.39 v34.61,72.39